# EAGLE design Leistungsstufe (EAGLE 9.6.2)
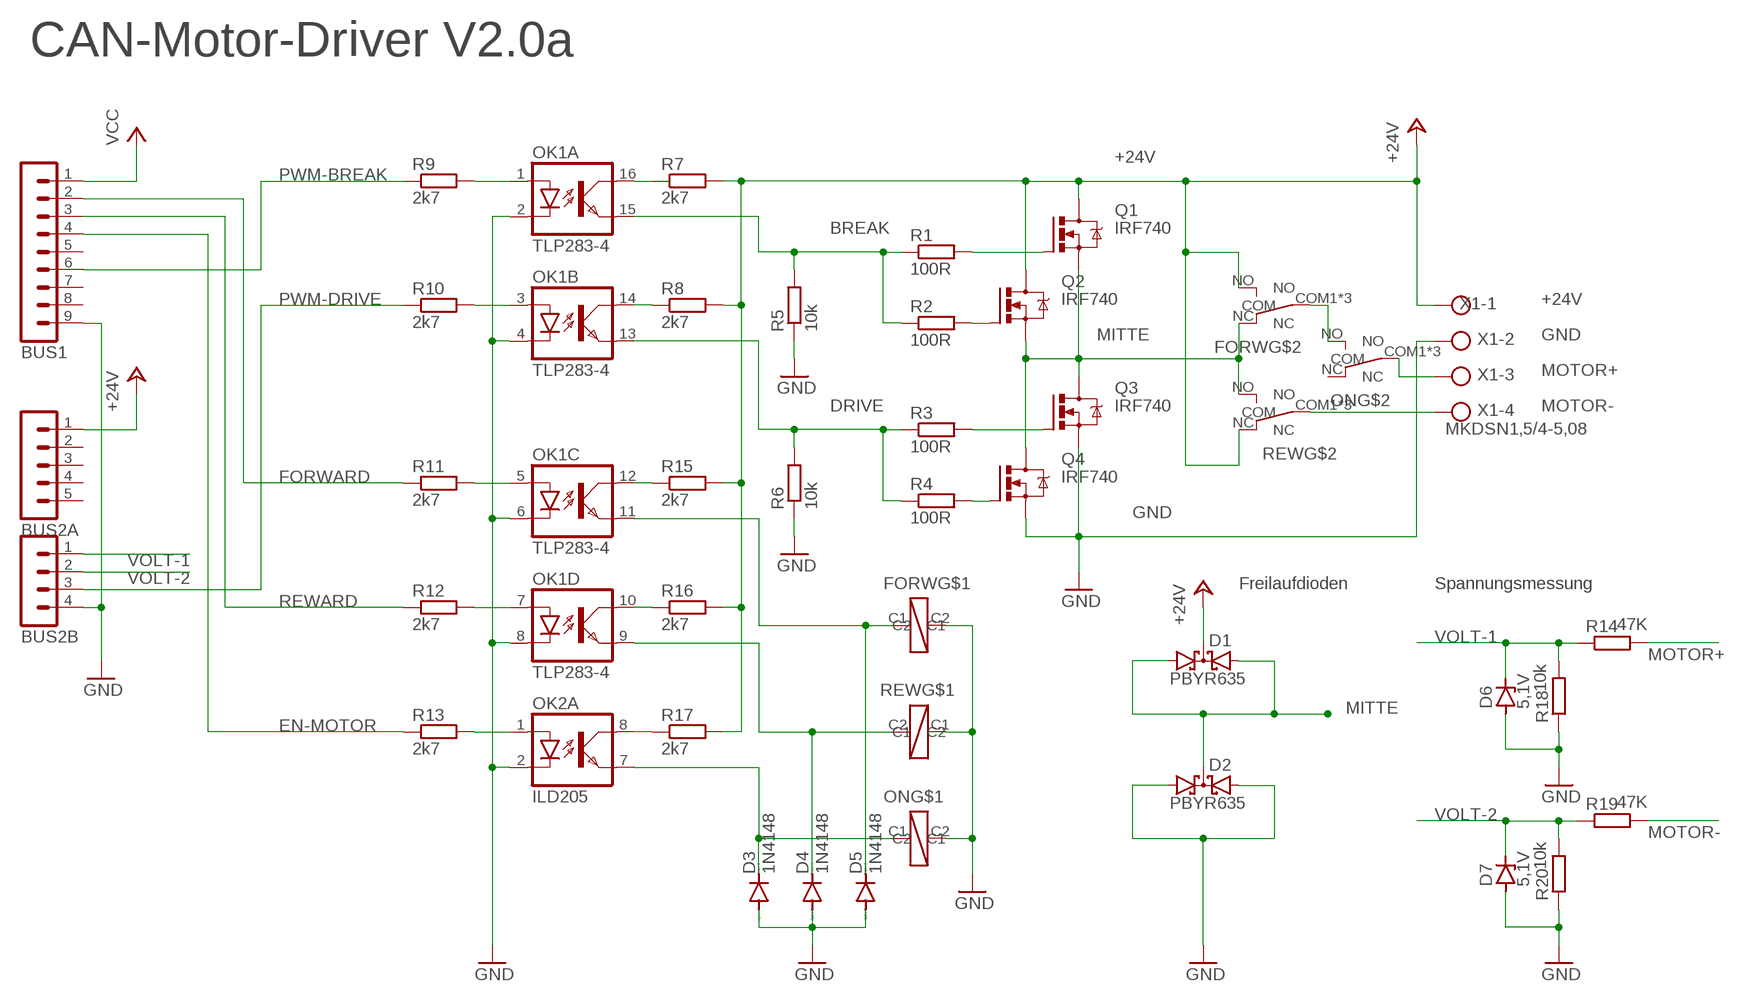
[diagram p0: schematic, sheet 1]

## Parts
BUS1  MA09-1  [MA09-1]
BUS2A  MA05-1  [MA05-1]
BUS2B  MA04-1  [MA04-1]
D1  PBYR635  [SOT82S]
D2  PBYR635  [SOT82S]
D3  1N4148  DIODE-SOD323-R  [SOD323-R]
D4  1N4148  DIODE-SOD323-R  [SOD323-R]
D5  1N4148  DIODE-SOD323-R  [SOD323-R]
D6  5,1V  ZENER-DIODESOD80C  [SOD80C]
D7  5,1V  ZENER-DIODESOD80C  [SOD80C]
FORW  FRA2C-2  [FRA2C-2]
OK1  TLP283-4  [MINI-FLAT-16]
OK2  ILD205  [SOIC08]
ON  FRA2C-2  [FRA2C-2]
Q1  IRF740  [TO220BV]
Q2  IRF740  [TO220BV]
Q3  IRF740  [TO220BV]
Q4  IRF740  [TO220BV]
R1  100R  R-EU_R0805  [R0805]
R2  100R  R-EU_R0805  [R0805]
R3  100R  R-EU_R0805  [R0805]
R4  100R  R-EU_R0805  [R0805]
R5  10k  R-EU_R0805  [R0805]
R6  10k  R-EU_R0805  [R0805]
R7  2k7  R-EU_R0805  [R0805]
R8  2k7  R-EU_R0805  [R0805]
R9  2k7  R-EU_R0805  [R0805]
R10  2k7  R-EU_R0805  [R0805]
R11  2k7  R-EU_R0805  [R0805]
R12  2k7  R-EU_R0805  [R0805]
R13  2k7  R-EU_R0805  [R0805]
R14  47K  R-EU_MELF0102W  [MINI_MELF-0102W]
R15  2k7  R-EU_R0805  [R0805]
R16  2k7  R-EU_R0805  [R0805]
R17  2k7  R-EU_R0805  [R0805]
R18  10k  R-EU_MELF0102W  [MINI_MELF-0102W]
R19  47K  R-EU_MELF0102W  [MINI_MELF-0102W]
R20  10k  R-EU_MELF0102W  [MINI_MELF-0102W]
REW  FRA2C-2  [FRA2C-2]
X1  MKDSN1,5/4-5,08  [MKDSN1,5/4-5,08]

## Nets
+24V: BUS2A.1 D1.C FORW.NO Q1.D Q2.D R7.2 R8.2 R15.2 R16.2 R17.2 REW.NC X1.1
BREAK: OK1.15(A:EMIT) R1.1 R2.1 R5.2
DRIVE: OK1.13(B:EMIT) R3.1 R4.1 R6.2
EN-MOTOR: BUS1.4 R13.1
FORWARD: BUS1.2 R11.1
GND: BUS1.9 BUS2B.4 D2.A1 D2.A2 D3.A D4.A D5.A D6.A D7.A FORW.C2 OK1.2(A:C) OK1.4(B:C) OK1.6(C:C) OK1.8(D:C) OK2.2(A:C) ON.C2 Q3.S Q4.S R5.1 R6.1 R18.1 R20.1 REW.C1 X1.2
M+SWITCH: FORW.COM1(COM) FORW.COM2(COM) FORW.COM3(COM) ON.NO
MITTE: D1.A1 D1.A2 D2.C FORW.NC Q1.S Q2.S Q3.D Q4.D REW.NO
MOTOR+: ON.COM1(COM) ON.COM2(COM) ON.COM3(COM) R14.2 X1.3
MOTOR-: R19.2 REW.COM1(COM) REW.COM2(COM) REW.COM3(COM) X1.4
N$1: Q2.G R2.2
N$2: Q3.G R3.2
N$3: Q4.G R4.2
N$5: Q1.G R1.2
N$6: OK1.3(B:A) R10.2
N$9: D5.C FORW.C1 OK1.11(C:EMIT)
N$10: D4.C OK1.9(D:EMIT) REW.C2
N$11: D3.C OK2.7(A:EMIT) ON.C1
N$12: OK1.16(A:COL) R7.1
N$13: OK1.14(B:COL) R8.1
N$14: OK1.1(A:A) R9.2
N$15: OK1.5(C:A) R11.2
N$16: OK1.7(D:A) R12.2
N$17: OK2.1(A:A) R13.2
N$19: OK1.10(D:COL) R16.1
N$20: OK2.8(A:COL) R17.1
N$22: OK1.12(C:COL) R15.1
PWM-BREAK: BUS1.6 R9.1
PWM-DRIVE: BUS2B.3 R10.1
REWARD: BUS1.3 R12.1
VCC: BUS1.1
VOLT-1: BUS2B.1 D6.C R14.1 R18.2
VOLT-2: BUS2B.2 D7.C R19.1 R20.2
Unconnected: BUS1.5 BUS1.7 BUS1.8 BUS2A.2 BUS2A.3 BUS2A.4 BUS2A.5 OK2.3(B:A) OK2.4(B:C) OK2.5(B:EMIT) OK2.6(B:COL) ON.NC

## Notes on the sheet
- CAN-Motor-Driver V2.0a
- Freilaufdioden | Spannungsmessung

## Library data of the parts
BUS1 = con-lstb:MA09-1: PIN HEADER; OC_FARNELL: unknown; OC_NEWARK: unknown
BUS2A = con-lstb:MA05-1: PIN HEADER; OC_FARNELL: unknown; OC_NEWARK: unknown
BUS2B = con-lstb:MA04-1: PIN HEADER; OC_FARNELL: unknown; OC_NEWARK: unknown
D1 D2 = diode:PBYR635: Dual DIODE common cathode
D3-D5 = diode:DIODE-: DIODE
D6 D7 = diode:ZENER-DIODE: Z-Diode
FORW ON REW = relais_auto:FRA2C-2
OK1 = optocoupler:TLP283-4: TOSHIBA PHOTOCOUPLER GaAs IRED & PHOTO-TRANSISTOR Source: http://www.semicon.toshiba.co.jp/td/en/Opto/Photocoupler/en_20050928_TLP283_datasheet.pdf; OC_FARNELL: unknown; OC_NEWARK: unknown
OK2 = optocoupler:ILD2*: Siemens ILD205/206/207/211/213/217 DUAL PHOTOTRANSISTOR SMALL OUTLINE SURFACE MOUNT OPTOCOUPLER Source: 153385-da-01-en-Optocoupler_ILD205-T.pdf; MF: VISHAY/TELEFUNKEN; MPN: ILD205T; OC_FARNELL: 1469512; OC_NEWARK: 20H8678
Q1-Q4 = transistor-power:IRF740: N-CHANNEL MOS FET
R1-R20 = rcl:R-EU_: RESISTOR, European symbol; SPICEPREFIX: R
X1 = con-phoenix-508:MKDSN1,5/4-5,08: MKDSN 1,5/ 4-5,08 Printklemme Nennstrom: 13,5 A Nennspannung: 250 V Rastermaß: 5,08 mm Polzahl: 4 Anschlussart: Schraubanschluss Montage: Löten Anschlussrichtung Leiter/Platine: 0 ° Artikelnummer: 1729144 Source: http://eshop.phoenixcontact.com .. 1729144.pdf

## Board
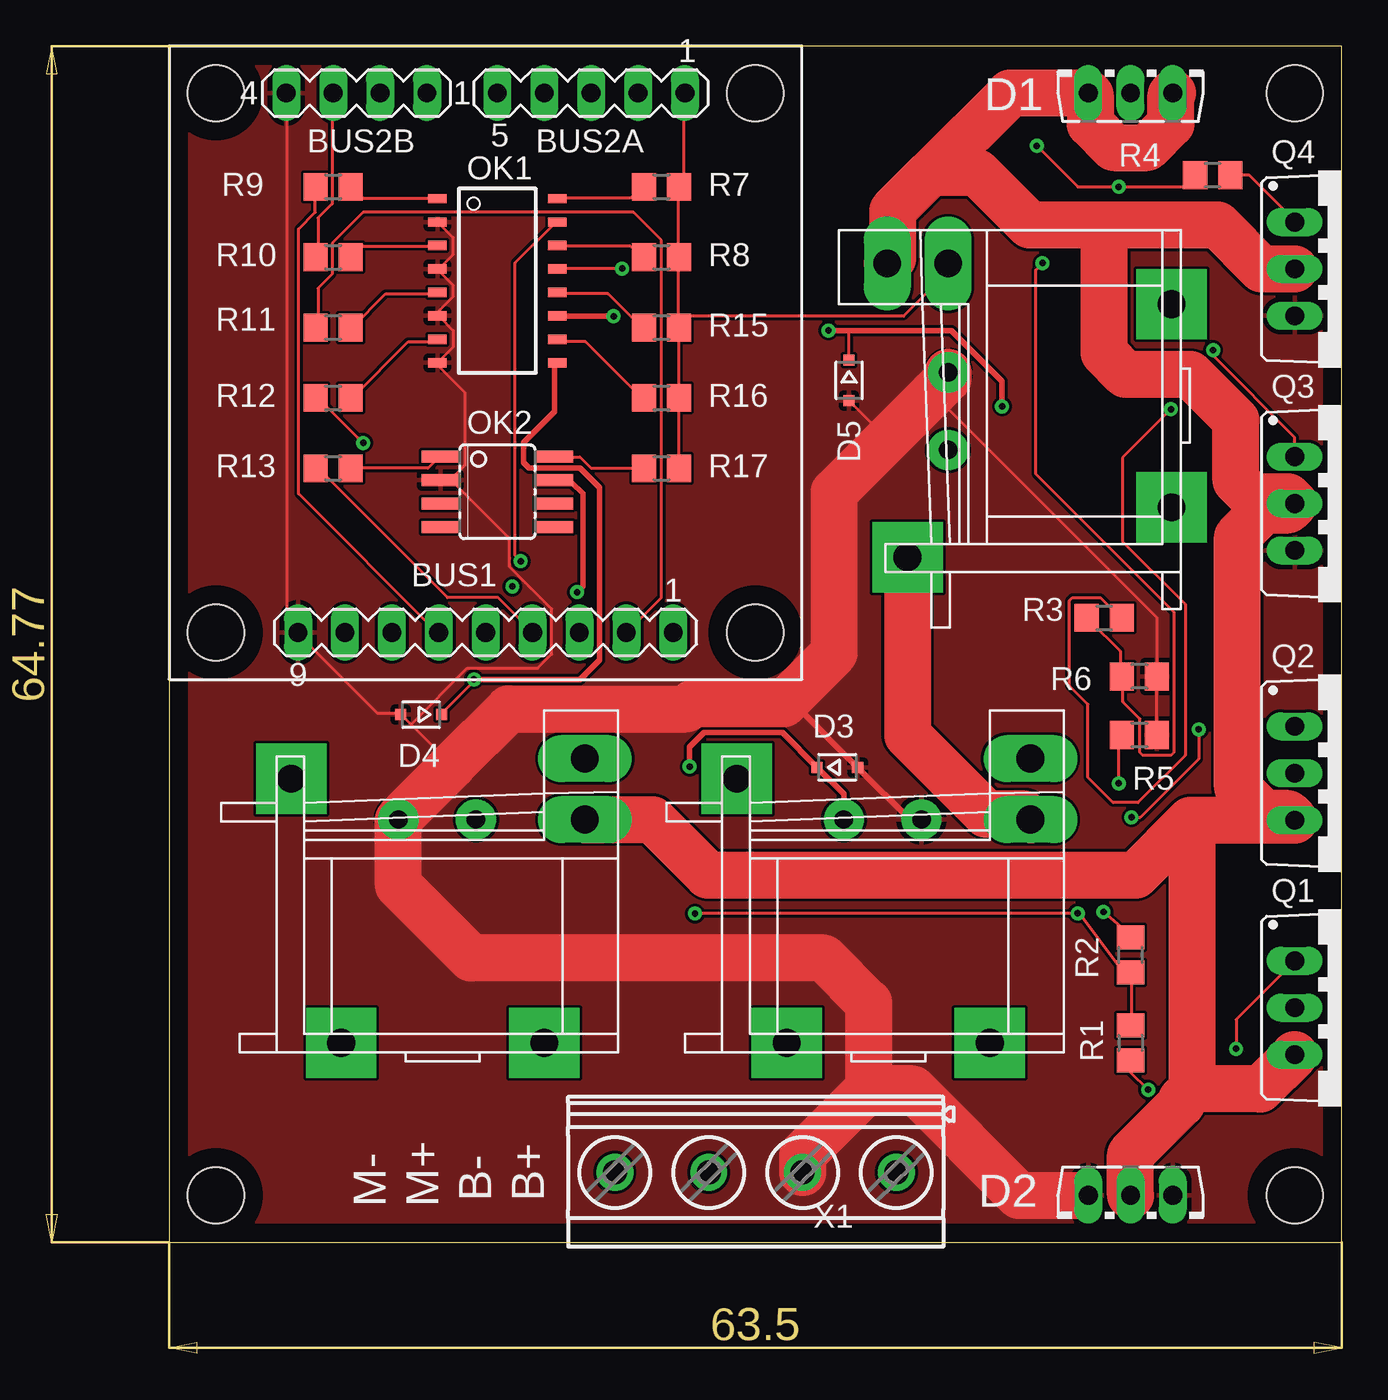
[diagram p1: board, top side]
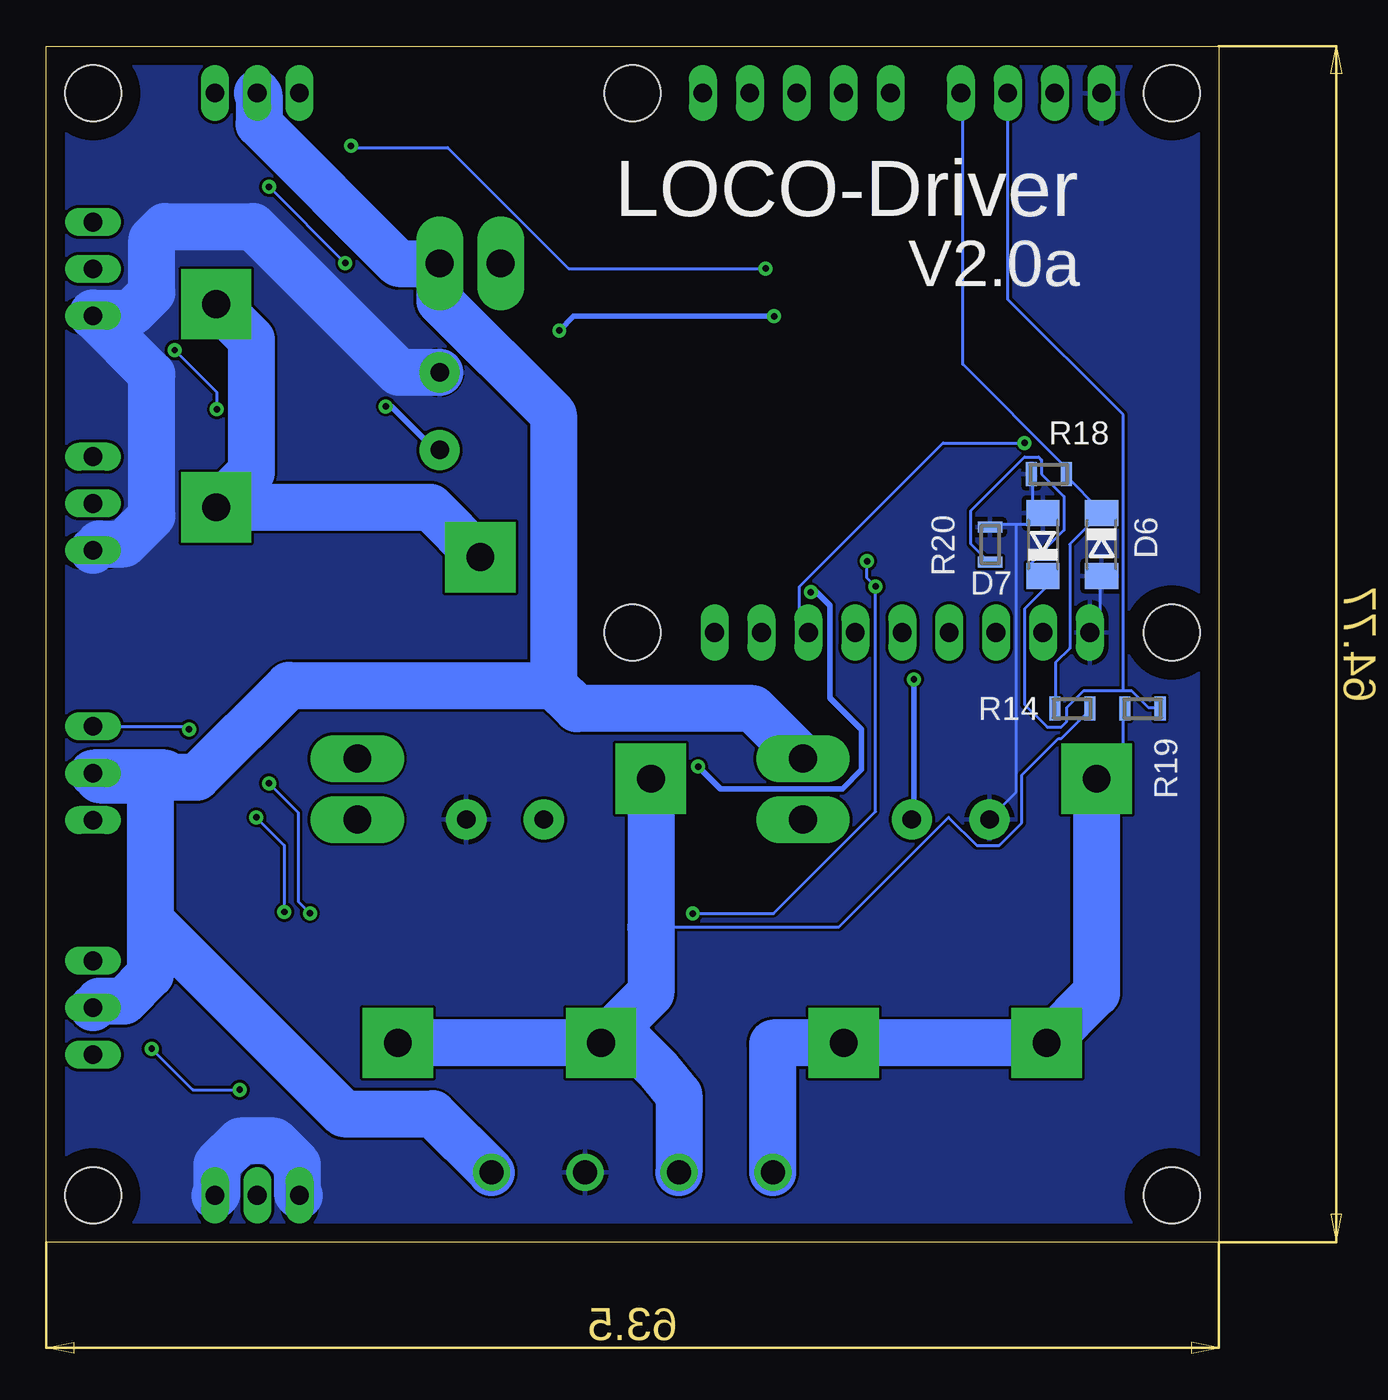
[diagram p2: board, bottom side, seen from below]

Size 63.5 x 64.77 mm. Coordinates in mm from the lower left corner, seen from the top.
Outline: 0,0 63.5,0 63.5,64.77 0,64.77 0,0
Copper layers (1*16): Top 0.035mm / dielectric 1.5mm / Bottom 0.035mm
Design rules "default": minimum track width 6mil, minimum drill 0.35mm, track to track 6mil, track to pad 6mil, pad to pad 6mil, via to via 6mil, smd to smd 6mil, copper to edge 40mil, drill to drill 6mil, minimum pad ring 10mil, minimum via ring 8mil, stop-mask expansion 4mil, vias tented up to drill 0mil, thermal gap 10mil
Holes 3.05 mm at 2.54,33.02 31.75,33.02 31.75,62.23 2.54,62.23 2.54,2.54 60.96,2.54 60.96,62.23

### Footprints (pad centres in the part's own frame; a part is rotated, then mirrored left to right if it is on the bottom)
MA09-1 = drill 1.016 long: 1 -10.16,0; 2 -7.62,0; 3 -5.08,0; 4 -2.54,0; 5 0,0; 6 2.54,0; 7 5.08,0; 8 7.62,0; 9 10.16,0
MA05-1 = drill 1.016 long: 1 -5.08,0; 2 -2.54,0; 3 0,0; 4 2.54,0; 5 5.08,0
MA04-1 = drill 1.016 long: 1 -3.81,0; 2 -1.27,0; 3 1.27,0; 4 3.81,0
SOT82S = drill 1.016 long: A1 -2.286,-1.27; A2 2.286,-1.27; C 0,-1.27
SOD323-R = smd 0.6 x 0.6: A 1.1,0; C -1.1,0
SOD80C = smd 1.4 x 1.8: A 1.7,0; C -1.7,0
FRA2C-2 = drill 1 pad 2.184: C1 -7.9,12.1; C2 -3.7,12.1 | drill 1.5 pad 3.81 square: COM1 0,0; COM2 -11,0; COM3 -13.7,14.3 | drill 1.5 pad 2.54 long: NC 2.2,15.4; NO 2.2,12.1
MINI-FLAT-16 = smd 1 x 0.5: 1 -3.24,4.445; 2 -3.24,3.175; 3 -3.24,1.905; 4 -3.24,0.635; 5 -3.24,-0.635; 6 -3.24,-1.905; 7 -3.24,-3.175; 8 -3.24,-4.445; 9 3.24,-4.445; 10 3.24,-3.175; 11 3.24,-1.905; 12 3.24,-0.635; 13 3.24,0.635; 14 3.24,1.905; 15 3.24,3.175; 16 3.24,4.445
SOIC08 = smd 0.66 x 2.032: 1 -1.905,-3.073; 2 -0.635,-3.073; 3 0.635,-3.073; 4 1.905,-3.073; 5 1.905,3.073; 6 0.635,3.073; 7 -0.635,3.073; 8 -1.905,3.073
TO220BV = drill 1.016 long: D 0,-2.54; G -2.54,-2.54; S 2.54,-2.54
R0805 = smd 1.3 x 1.5: 1 -0.95,0; 2 0.95,0
MINI_MELF-0102W = smd 0.6 x 1.3: 1 -0.95,0; 2 0.95,0
MKDSN1,5/4-5,08 = drill 1.3 pad 2: 1 -7.641,0.025; 2 -2.561,0.025; 3 2.519,0.025; 4 7.599,0.025

### Placement (x,y rotation side)
BUS1  17.14,33.02 180 top
BUS2A  22.86,62.23 180 top
BUS2B  10.16,62.23 180 top
D1  52.07,63.5 0 top
D2  52.07,1.27 180 top
D3  36.2,25.72 0 top
D4  13.65,28.57 180 top
D5  36.83,46.67 270 top
D6  6.35,37.78 270 bottom
D7  9.53,37.78 90 bottom
FORW  54.29,50.8 90 top
OK1  17.78,52.07 0 top
OK2  17.78,40.64 270 top
ON  44.45,10.79 0 top
Q1  63.5,12.7 270 top
Q2  63.5,25.4 270 top
Q3  63.5,40.01 270 top
Q4  63.5,52.7 270 top
R1  52.07,10.79 270 top
R2  52.07,15.56 90 top
R3  50.64,33.81 0 top
R4  56.52,57.78 0 top
R5  52.55,27.46 180 top
R6  52.55,30.64 180 top
R7  26.67,57.15 0 top
R8  26.67,53.34 0 top
R9  8.89,57.15 0 top
R10  8.89,53.34 0 top
R11  8.89,49.53 0 top
R12  8.89,45.72 0 top
R13  8.89,41.91 0 top
R14  7.94,28.89 0 bottom
R15  26.67,49.53 0 top
R16  26.67,45.72 0 top
R17  26.67,41.91 0 top
R18  9.21,41.59 0 bottom
R19  4.13,28.89 180 bottom
R20  12.38,37.78 270 bottom
REW  20.32,10.79 0 top
X1  31.75,3.81 180 top

### Tracks (layer width: path | path; a pad name or v marks a point on that pad's centre or on a via)
+24V
  Top 0.152: 27.58,50.14 27.58,49.53 | 27.58,50.14 39.78,50.14 42.23,52.59 FORW.NO | 27.58,45.72 27.58,41.91 R17.2 | 27.58,49.53 27.58,45.72 | 27.58,45.72 R16.2 | 27.58,49.53 R15.2 27.58,50.14 | 27.58,50.14 27.58,53.34 | 27.58,53.34 27.58,57.15 R7.2 27.74,57.15 27.89,57.3 27.89,62.18 BUS2A.1 | 27.58,53.34 R8.2
  Bottom 2.54: X1.1 42.57,6.96 47.39,6.96 57.85,17.43 | Q1.D 60.6,13.06 59.29,13.06 57.85,14.49 57.85,17.43 | 57.85,17.43 57.85,25.04 60.6,25.04 Q2.D 57.05,25.4 56.83,25.17 55.34,25.17 50.35,30.16 36.04,30.16 | 36.04,30.16 36.03,30.14 36.03,44.81 42.19,50.97 FORW.NO 44.41,53 51.97,60.56 51.97,62.13 D1.C | 36.04,30.16 36.02,30.16 34.76,28.89 25.22,28.89 REW.NC
BREAK  (via drill 0.35)
  Top 0.152: v28.49,17.8 49.19,17.8 v49.21,17.82 49.21,17.93 51.67,14.61 R2.1 52.12,14.59 52.12,11.89 R1.1 | v51.44,24.85 51.44,27.46 R5.2 | v19.05,36.88 18.75,37.19 18.75,53.03 20.88,55.17 OK1.15
  Bottom 0.152: v28.49,17.8 24.11,17.8 18.59,23.32 v18.59,35.51 19.05,35.97 v19.05,36.88 | v51.44,24.85 49.85,23.27 49.85,18.45 v49.21,17.82
DRIVE  (via drill 0.35)
  Top 0.152: R3.1 49.84,33.68 51.51,32 51.51,30.79 R6.2 51.66,30.63 51.66,29.26 52.58,28.35 52.58,26.52 52.73,26.36 54.25,26.36 54.41,26.52 54.41,34.14 46.94,41.6 46.94,52.65 v47.31,53.02 | v46.99,59.37 49.21,57.15 v51.44,57.15 54.93,57.15 R4.1 | v24.54,52.73 21.03,52.73 OK1.13
  Bottom 0.152: v47.31,53.02 v51.44,57.15 | v24.54,52.73 35.2,52.73 41.76,59.28 46.94,59.28 v46.99,59.37
EN-MOTOR
  Top 0.152: R13.1 8.08,41.91 15.09,34.9 17.83,34.9 19.66,33.07 BUS1.4
FORWARD
  Top 0.152: R11.1 8.08,49.53 8.08,51.66 8.84,52.43 8.84,54.1 10.52,55.78 25.15,55.78 26.67,54.25 26.67,34.9 24.84,33.07 BUS1.2
GND
  Top 0.152: R5.1 R6.1 53.5,33.83 41.37,45.96 | D5.A 38.83,43.57 38.98,43.57 | OK1.2 14.63,55.17 15.39,54.41 15.39,53.49 14.63,52.73 OK1.4 14.63,52.58 15.39,51.82 15.39,51.21 14.63,50.44 14.63,50.29 OK1.6 14.63,50.14 15.39,49.38 15.39,48.48 OK1.8 14.54,47.5 16,46.04 16,42.06 15.24,41.3 | 15.24,41.3 14.78,41.3 OK2.2 15.24,41.3 | 15.34,25.81 13.11,28.04 | 13.11,28.04 12.65,28.5 D4.A 12.5,28.65 11.28,28.65 7.01,32.92 BUS1.9 6.86,33.07 6.4,33.53 6.4,62.18 BUS2B.4 | 15.24,41.3 18.44,38.1 18.44,36.58 20.73,34.29 20.73,31.85 19.96,31.09 16.15,31.09 13.11,28.04
  Top 0.305: ON.C2 40.12,22.89 D3.A 33.84,29.17 33.3,29.17
  Top 1.27: 49.21,2.54 D2.A2
  Top 2.54: 37.89,8.3 37.89,12.97 35.47,15.39 16.37,15.39 12.42,19.34 REW.C1 15.34,25.81 18.41,28.89 28.03,28.89 28.32,29.17 33.3,29.17 36.04,31.91 36.04,40.63 38.98,43.57 41.37,45.96 42.19,46.78 FORW.C2 | X1.2 34.31,4.72 37.89,8.3 | 37.89,8.3 40.28,8.3 46.04,2.54 49.21,2.54
  Bottom 0.152: 10.21,38.86 9.6,39.47 D7.A | 10.06,40.08 9.6,39.62 D7.A | 10.06,40.08 10.06,41.45 R18.1 | 10.06,40.08 D7.A | 10.21,38.86 10.97,38.86 | 10.97,38.86 12.34,38.86 R20.1 | 10.21,38.86 D7.A | D6.A 6.4,35.97 6.4,33.53 6.86,33.07 BUS1.9 | 10.97,38.86 10.97,24.38 12.34,23.01 REW.C1
  Bottom 2.54: Q3.S 60.6,37.82 59.29,37.82 57.78,39.33 57.78,46.99 Q4.S 60.96,50.33 58.9,50.32 57.78,51.44 57.78,54.29 57.08,55 52.29,55 44.4,47.1 FORW.C2 | D2.A2 49.89,2.64 49.89,4.21 51.16,5.49 52.98,5.49 54.25,4.21 54.25,2.64 D2.A1
  pour Bottom: 0,64.77 0,0 63.5,0 63.5,64.77
  pour Top: 0,64.77 0,0 63.5,0 63.5,64.77
M+SWITCH
  Top 2.54: ON.NO 46.36,23.18 44.27,23.18 39.99,27.46 FORW.COM3
  Bottom 2.54: FORW.COM1 52.39,48.9 52.39,41.7 FORW.COM2 42.69,39.8 FORW.COM3
MITTE
  Top 2.54: Q1.S 59.09,8.29 55.4,8.29 | 55.4,8.29 55.4,22.86 Q2.S | Q2.S 60.6,23.22 59.29,23.22 57.85,24.65 57.85,38.21 59.29,39.65 60.6,39.65 Q3.D 60.6,40.36 58.66,40.36 57.78,41.24 57.78,44.52 55.3,47 51.8,47 50.64,48.15 50.64,55.08 | REW.NO 26.18,22.89 29.19,19.89 52.34,19.89 55.32,22.86 Q2.S | 41.24,57.91 43.78,57.91 46.62,55.08 50.64,55.08 | 41.24,57.91 39.18,55.86 39.18,53.29 FORW.NC | Q4.D 59.16,52.7 56.79,55.08 50.64,55.08 | 41.24,57.91 45.56,62.23 D1.A1 49.89,62.13 49.89,60.56 51.16,59.28 52.98,59.28 54.25,60.56 54.25,62.13 D1.A2 | 55.4,8.29 54.82,7.71 54.82,7.51 52.07,4.76 D2.C
MOTOR+
  Bottom 0.152: 30.75,17.07 20.57,17.07 14.63,23.01 13.11,21.49 11.89,21.49 10.67,22.71 10.67,25.3 8.69,27.28 8.53,27.28 7.01,28.8 R14.2
  Bottom 2.54: ON.COM3 30.75,17.07 30.75,13.49 ON.COM2 | ON.COM2 ON.COM1 | ON.COM2 31.8,10.79 30.32,9.32 29.23,7.99 X1.3
MOTOR-
  Bottom 0.152: R19.2 5.18,28.8 5.18,26.67 5.79,26.06 REW.COM3
  Bottom 2.54: REW.COM3 6.62,13.49 REW.COM2 REW.COM1 24.13,10.79 24.16,10.77 24.15,10.76 X1.4
N$1  (via drill 0.35)
  Top 0.152: v55.77,27.77 55.77,26.18 52.6,23.01 v52.12,23.01 | v50.61,17.89 52.13,16.59 R2.2
  Bottom 0.152: v50.61,17.89 50.61,21.5 v52.12,23.01 | v55.77,27.77 55.92,27.93 60.96,27.93 Q2.G
N$2  (via drill 0.35)
  Top 0.152: v54.25,45.11 51.63,42.49 51.63,37.95 55.03,34.56 55.03,26.36 52.48,23.81 51.12,23.81 49.77,25.16 49.77,29.13 48.77,30.12 48.77,34.75 48.92,34.9 50.44,34.9 51.51,33.83 R3.2 | v56.54,48.31 56.54,48.01 60.96,43.59 Q3.G
  Bottom 0.152: v54.25,45.11 54.25,46.02 v56.54,48.31
N$3
  Top 0.152: R4.2 58.5,57.78 60.96,55.32 Q4.G
N$5  (via drill 0.35)
  Top 0.152: Q1.G 57.78,12.06 v57.78,10.48 | v53.02,8.26 52.07,9.21 R1.2
  Bottom 0.152: v57.78,10.48 55.56,8.26 v53.02,8.26
N$6
  Top 0.152: OK1.3 14.48,53.95 10.52,53.95 9.91,53.34 R10.2
N$9  (via drill 0.35)
  Top 0.152: 21.03,50.14 OK1.11 | D5.C 36.83,49.37
  Top 0.305: v24.08,50.14 21.03,50.14 | v35.71,49.37 36.83,49.37 42.37,49.37 45.11,46.63 v45.11,45.26
  Bottom 0.305: v24.08,50.14 34.94,50.14 v35.71,49.37 | v45.11,45.26 44.81,45.26 42.48,42.94 FORW.C1
N$10  (via drill 0.35)
  Top 0.152: 20.88,47.55 OK1.9 | 16.61,30.48 14.78,28.65 D4.C
  Top 0.305: 20.88,47.55 20.88,44.98 19.19,43.29 19.19,42.22 19.49,41.91 22.26,41.91 23.32,40.86 23.32,31.53 22.26,30.48 16.61,30.48 v16.51,30.48
  Bottom 0.305: v16.51,30.48 16.51,23 REW.C2
N$11  (via drill 0.35)
  Top 0.152: 20.88,41.15 OK2.7
  Top 0.305: 20.88,41.15 21.81,41.15 22.42,40.54 22.42,35.52 v22.1,35.2 | v28.19,25.76 28.19,26.82 28.97,27.6 33.22,27.6 D3.C 36.55,24.26 ON.C1
  Bottom 0.305: v22.1,35.2 21.78,35.2 21.04,34.47 21.04,29.48 19.34,27.77 19.34,25.6 20.39,24.56 27,24.56 v28.19,25.76
N$12
  Top 0.152: OK1.16 21.03,56.54 24.99,56.54 25.6,57.15 R7.1
N$13
  Top 0.152: R8.1 25.6,53.34 24.99,53.95 21.03,53.95 OK1.14
N$14
  Top 0.152: OK1.1 14.48,56.54 10.52,56.54 9.91,57.15 R9.2
N$15
  Top 0.152: OK1.5 14.48,51.36 11.73,51.36 9.91,49.53 R11.2
N$16
  Top 0.152: OK1.7 14.48,48.77 12.95,48.77 9.91,45.72 R12.2
N$17
  Top 0.152: R13.2 14.02,41.91 14.63,42.52 OK2.1
N$19
  Top 0.152: OK1.10 21.03,48.77 22.55,48.77 25.6,45.72 R16.1
N$20
  Top 0.152: R17.1 22.86,41.91 22.25,42.52 20.88,42.52 OK2.8
N$22
  Top 0.152: OK1.12 21.03,51.36 23.77,51.36 25.6,49.53 R15.1
PWM-BREAK
  Top 0.152: R9.1 7.92,57.15 7.92,55.78 7.01,54.86 7.01,40.54 14.48,33.07 BUS1.6
PWM-DRIVE
  Top 0.152: R10.1 8.08,53.34 8.08,55.47 8.84,56.24 8.84,62.18 BUS2B.3
REWARD  (via drill 0.35)
  Top 0.152: v10.52,43.28 8.08,45.72 R12.1
  Bottom 0.152: v10.52,43.28 14.94,43.28 22.71,35.51 22.71,33.53 22.25,33.07 BUS1.3
VOLT-1
  Bottom 0.152: 13.87,60.96 13.87,62.18 BUS2B.1 13.87,60.96 | R14.1 8.84,28.96 8.84,31.39 8.08,32.16 8.08,37.8 6.4,39.47 D6.C 6.4,39.62 8.23,41.45 R18.2 8.38,41.6 8.38,42.06 13.87,47.55 13.87,60.96
VOLT-2
  Bottom 0.152: 10.21,36.73 9.6,36.12 D7.C | 9.14,35.66 9.45,35.97 D7.C | 10.21,36.73 8.38,38.56 8.38,40.39 9.6,41.6 9.6,42.37 9.75,42.52 10.52,42.52 13.41,39.62 13.41,37.8 12.5,36.88 R20.2 | 10.21,36.73 D7.C | 5.18,29.87 7.32,29.87 8.23,28.96 8.23,28.19 8.53,27.89 9.3,27.89 10.52,29.11 10.52,34.29 9.14,35.66 | 5.18,29.87 4.72,29.87 3.81,28.96 3.2,28.96 R19.1 | 9.14,35.66 D7.C | BUS2B.2 11.43,51.05 5.18,44.81 5.18,29.87

### Text on the board
tNames: M- | M+ | B- | B+
bNames: LOCO-Driver | V2.0a